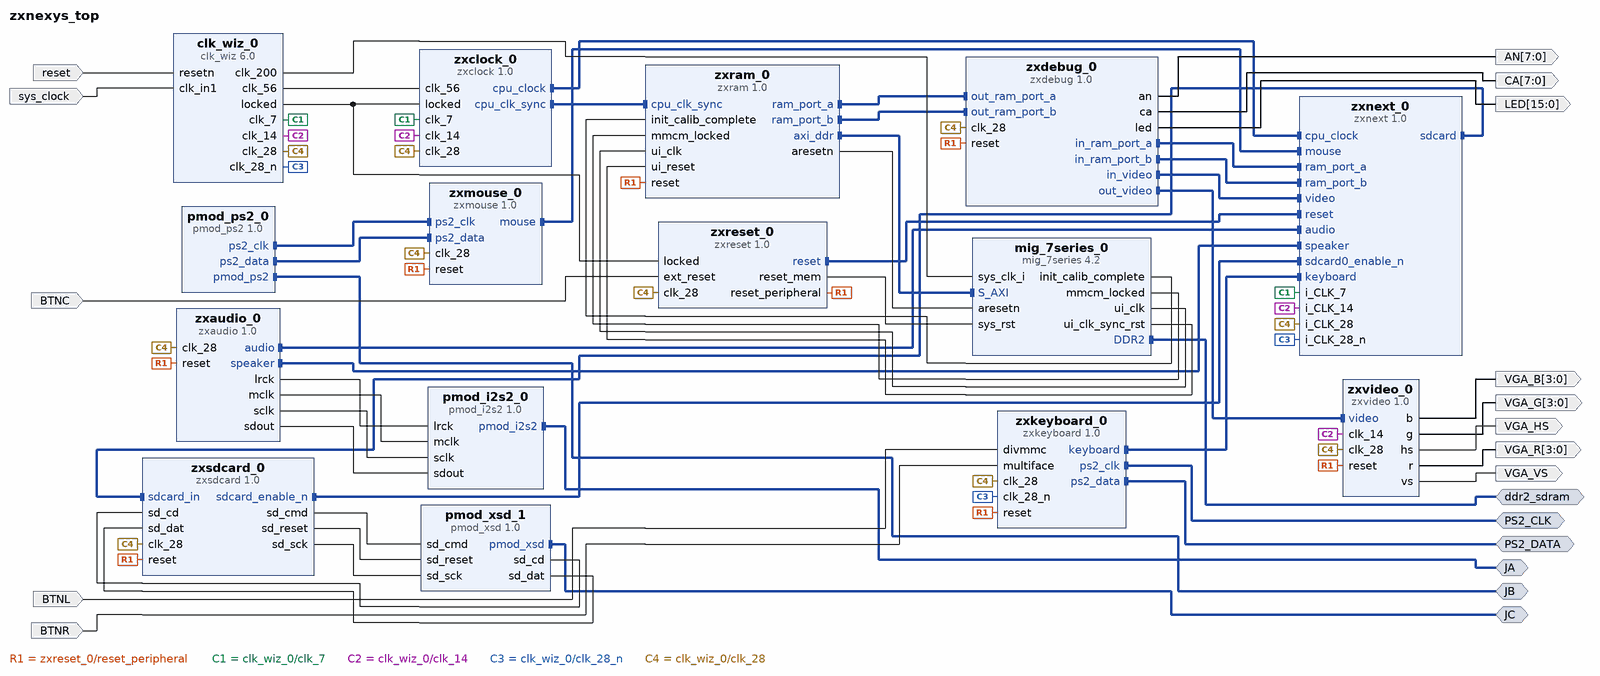
[diagram p0: block diagram of the top level]
# Vivado block design zxnexys_top, xc7a100tcsg324-1, Vivado 2021.1.1
create_bd_design zxnexys_top

create_bd_intf_port -mode Master -vlnv digilentinc.com:interface:pmod_rtl:1.0 JA
create_bd_intf_port -mode Master -vlnv digilentinc.com:interface:pmod_rtl:1.0 JB
create_bd_intf_port -mode Master -vlnv xilinx.com:interface:gpio_rtl:1.0 PS2_CLK
create_bd_intf_port -mode Master -vlnv xilinx.com:interface:gpio_rtl:1.0 PS2_DATA
create_bd_intf_port -mode Master -vlnv digilentinc.com:interface:pmod_rtl:1.0 JC
create_bd_intf_port -mode Master -vlnv xilinx.com:interface:ddrx_rtl:1.0 ddr2_sdram
create_bd_port -dir I BTNL
create_bd_port -dir I BTNR
create_bd_port -dir O -from 3 -to 0 VGA_R
create_bd_port -dir O -from 3 -to 0 VGA_G
create_bd_port -dir O -from 3 -to 0 VGA_B
create_bd_port -dir O VGA_HS
create_bd_port -dir O VGA_VS
create_bd_port -dir I BTNC
create_bd_port -dir O -from 7 -to 0 CA
create_bd_port -dir O -from 7 -to 0 AN
create_bd_port -dir O -from 15 -to 0 LED
create_bd_port -dir I -type clk sys_clock
set_property -dict {CONFIG.FREQ_HZ 100000000 CONFIG.PHASE 0.0} [get_bd_ports sys_clock]
create_bd_port -dir I -type rst reset
set_property -dict {CONFIG.POLARITY ACTIVE_LOW} [get_bd_ports reset]

create_bd_cell -type ip -vlnv specnext.com:specnext:zxaudio:1.0 zxaudio_0
create_bd_cell -type ip -vlnv specnext.com:specnext:zxkeyboard:1.0 zxkeyboard_0
create_bd_cell -type ip -vlnv specnext.com:specnext:zxmouse:1.0 zxmouse_0
create_bd_cell -type ip -vlnv specnext.com:specnext:zxvideo:1.0 zxvideo_0
create_bd_cell -type ip -vlnv sepcnext.com:specnext:pmod_i2s2:1.0 pmod_i2s2_0
create_bd_cell -type ip -vlnv specnext.com:specnext:pmod_ps2:1.0 pmod_ps2_0
create_bd_cell -type ip -vlnv specnext.com:specnext:pmod_xsd:1.0 pmod_xsd_1
create_bd_cell -type ip -vlnv xilinx.com:ip:mig_7series:4.2 mig_7series_0
set_property -dict [list \
  CONFIG.BOARD_MIG_PARAM ddr2_sdram \
  CONFIG.MIG_DONT_TOUCH_PARAM Custom \
  CONFIG.RESET_BOARD_INTERFACE Custom \
  CONFIG.XML_INPUT_FILE mig_b.prj \
] [get_bd_cells mig_7series_0]
create_bd_cell -type ip -vlnv specnext.com:specnext:zxsdcard:1.0 zxsdcard_0
create_bd_cell -type ip -vlnv specnext.com:specnext:zxdebug:1.0 zxdebug_0
create_bd_cell -type ip -vlnv specnext.com:specnext:zxreset:1.0 zxreset_0
create_bd_cell -type ip -vlnv specnext.com:specnext:zxnext:1.0 zxnext_0
create_bd_cell -type ip -vlnv specnext.com:specnext:zxram:1.0 zxram_0
create_bd_cell -type ip -vlnv xilinx.com:ip:clk_wiz:6.0 clk_wiz_0
set_property -dict [list \
  CONFIG.CLKOUT1_JITTER 120.598 \
  CONFIG.CLKOUT1_PHASE_ERROR 105.461 \
  CONFIG.CLKOUT1_REQUESTED_OUT_FREQ 200 \
  CONFIG.CLKOUT2_JITTER 155.428 \
  CONFIG.CLKOUT2_PHASE_ERROR 105.461 \
  CONFIG.CLKOUT2_REQUESTED_OUT_FREQ 56.25 \
  CONFIG.CLKOUT2_USED true \
  CONFIG.CLKOUT3_JITTER 179.253 \
  CONFIG.CLKOUT3_PHASE_ERROR 105.461 \
  CONFIG.CLKOUT3_REQUESTED_OUT_FREQ 28.125 \
  CONFIG.CLKOUT3_USED true \
  CONFIG.CLKOUT4_JITTER 179.253 \
  CONFIG.CLKOUT4_PHASE_ERROR 105.461 \
  CONFIG.CLKOUT4_REQUESTED_OUT_FREQ 28.125 \
  CONFIG.CLKOUT4_USED true \
  CONFIG.CLKOUT5_JITTER 205.339 \
  CONFIG.CLKOUT5_PHASE_ERROR 105.461 \
  CONFIG.CLKOUT5_REQUESTED_OUT_FREQ 14.0625 \
  CONFIG.CLKOUT5_USED true \
  CONFIG.CLKOUT6_JITTER 234.771 \
  CONFIG.CLKOUT6_PHASE_ERROR 105.461 \
  CONFIG.CLKOUT6_REQUESTED_OUT_FREQ 7.03125 \
  CONFIG.CLKOUT6_USED true \
  CONFIG.CLK_IN1_BOARD_INTERFACE sys_clock \
  CONFIG.CLK_OUT1_PORT clk_200 \
  CONFIG.CLK_OUT4_PORT clk_28_n \
  CONFIG.MMCM_CLKFBOUT_MULT_F 9.000 \
  CONFIG.MMCM_CLKOUT0_DIVIDE_F 4.500 \
  CONFIG.MMCM_CLKOUT1_DIVIDE 16 \
  CONFIG.MMCM_CLKOUT2_DIVIDE 32 \
  CONFIG.MMCM_CLKOUT3_DIVIDE 32 \
  CONFIG.MMCM_CLKOUT4_DIVIDE 64 \
  CONFIG.MMCM_CLKOUT5_DIVIDE 128 \
  CONFIG.NUM_OUT_CLKS 6 \
  CONFIG.RESET_BOARD_INTERFACE reset \
  CONFIG.RESET_PORT resetn \
  CONFIG.RESET_TYPE ACTIVE_LOW \
  CONFIG.USE_BOARD_FLOW true \
] [get_bd_cells clk_wiz_0]
create_bd_cell -type ip -vlnv specnext.com:specnext:zxclock:1.0 zxclock_0

# ---- connections ----

connect_bd_intf_net [get_bd_intf_ports ddr2_sdram] [get_bd_intf_pins mig_7series_0/DDR2]
connect_bd_intf_net [get_bd_intf_ports JA] [get_bd_intf_pins pmod_i2s2_0/pmod_i2s2]
connect_bd_intf_net [get_bd_intf_ports JB] [get_bd_intf_pins pmod_ps2_0/pmod_ps2]
connect_bd_intf_net [get_bd_intf_ports JC] [get_bd_intf_pins pmod_xsd_1/pmod_xsd]
connect_bd_intf_net [get_bd_intf_pins zxclock_0/cpu_clk_sync] [get_bd_intf_pins zxram_0/cpu_clk_sync]
connect_bd_intf_net [get_bd_intf_pins zxclock_0/cpu_clock] [get_bd_intf_pins zxnext_0/cpu_clock]
connect_bd_intf_net [get_bd_intf_pins zxram_0/ram_port_a] [get_bd_intf_pins zxdebug_0/out_ram_port_a]
connect_bd_intf_net [get_bd_intf_pins zxram_0/ram_port_b] [get_bd_intf_pins zxdebug_0/out_ram_port_b]
connect_bd_intf_net [get_bd_intf_pins zxdebug_0/out_video] [get_bd_intf_pins zxvideo_0/video]
connect_bd_intf_net [get_bd_intf_ports PS2_CLK] [get_bd_intf_pins zxkeyboard_0/ps2_clk]
connect_bd_intf_net [get_bd_intf_ports PS2_DATA] [get_bd_intf_pins zxkeyboard_0/ps2_data]
connect_bd_intf_net [get_bd_intf_pins pmod_ps2_0/ps2_clk] [get_bd_intf_pins zxmouse_0/ps2_clk]
connect_bd_intf_net [get_bd_intf_pins pmod_ps2_0/ps2_data] [get_bd_intf_pins zxmouse_0/ps2_data]
connect_bd_intf_net [get_bd_intf_pins zxaudio_0/audio] [get_bd_intf_pins zxnext_0/audio]
connect_bd_intf_net [get_bd_intf_pins zxkeyboard_0/keyboard] [get_bd_intf_pins zxnext_0/keyboard]
connect_bd_intf_net [get_bd_intf_pins zxmouse_0/mouse] [get_bd_intf_pins zxnext_0/mouse]
connect_bd_intf_net [get_bd_intf_pins zxdebug_0/in_ram_port_a] [get_bd_intf_pins zxnext_0/ram_port_a]
connect_bd_intf_net [get_bd_intf_pins zxdebug_0/in_ram_port_b] [get_bd_intf_pins zxnext_0/ram_port_b]
connect_bd_intf_net [get_bd_intf_pins zxsdcard_0/sdcard_in] [get_bd_intf_pins zxnext_0/sdcard]
connect_bd_intf_net [get_bd_intf_pins zxsdcard_0/sdcard_enable_n] [get_bd_intf_pins zxnext_0/sdcard0_enable_n]
connect_bd_intf_net [get_bd_intf_pins zxaudio_0/speaker] [get_bd_intf_pins zxnext_0/speaker]
connect_bd_intf_net [get_bd_intf_pins zxdebug_0/in_video] [get_bd_intf_pins zxnext_0/video]
connect_bd_intf_net [get_bd_intf_pins zxram_0/axi_ddr] [get_bd_intf_pins mig_7series_0/S_AXI]
connect_bd_intf_net [get_bd_intf_pins zxreset_0/reset] [get_bd_intf_pins zxnext_0/reset]
connect_bd_net [get_bd_ports BTNC] [get_bd_pins zxreset_0/ext_reset]
connect_bd_net [get_bd_ports BTNL] [get_bd_pins zxkeyboard_0/divmmc]
connect_bd_net [get_bd_ports BTNR] [get_bd_pins zxkeyboard_0/multiface]
connect_bd_net [get_bd_pins zxreset_0/reset_peripheral] \
  [get_bd_pins zxaudio_0/reset] [get_bd_pins zxkeyboard_0/reset] [get_bd_pins zxmouse_0/reset] [get_bd_pins zxvideo_0/reset] \
  [get_bd_pins zxsdcard_0/reset] [get_bd_pins zxdebug_0/reset] [get_bd_pins zxram_0/reset]
connect_bd_net [get_bd_pins clk_wiz_0/clk_7] [get_bd_pins zxnext_0/i_CLK_7] [get_bd_pins zxclock_0/clk_7]
connect_bd_net [get_bd_pins clk_wiz_0/clk_14] [get_bd_pins zxvideo_0/clk_14] [get_bd_pins zxnext_0/i_CLK_14] [get_bd_pins zxclock_0/clk_14]
connect_bd_net [get_bd_pins clk_wiz_0/clk_56] [get_bd_pins zxclock_0/clk_56]
connect_bd_net [get_bd_pins clk_wiz_0/clk_200] [get_bd_pins mig_7series_0/sys_clk_i]
connect_bd_net [get_bd_pins clk_wiz_0/clk_28_n] [get_bd_pins zxkeyboard_0/clk_28_n] [get_bd_pins zxnext_0/i_CLK_28_n]
connect_bd_net [get_bd_pins clk_wiz_0/locked] [get_bd_pins zxreset_0/locked] [get_bd_pins zxclock_0/locked]
connect_bd_net [get_bd_pins mig_7series_0/init_calib_complete] [get_bd_pins zxram_0/init_calib_complete]
connect_bd_net [get_bd_pins mig_7series_0/mmcm_locked] [get_bd_pins zxram_0/mmcm_locked]
connect_bd_net [get_bd_pins mig_7series_0/ui_clk] [get_bd_pins zxram_0/ui_clk]
connect_bd_net [get_bd_pins mig_7series_0/ui_clk_sync_rst] [get_bd_pins zxram_0/ui_reset]
connect_bd_net [get_bd_pins pmod_xsd_1/sd_cd] [get_bd_pins zxsdcard_0/sd_cd]
connect_bd_net [get_bd_pins pmod_xsd_1/sd_dat] [get_bd_pins zxsdcard_0/sd_dat]
connect_bd_net [get_bd_ports reset] [get_bd_pins clk_wiz_0/resetn]
connect_bd_net [get_bd_ports sys_clock] [get_bd_pins clk_wiz_0/clk_in1]
connect_bd_net [get_bd_pins zxaudio_0/lrck] [get_bd_pins pmod_i2s2_0/lrck]
connect_bd_net [get_bd_pins zxaudio_0/mclk] [get_bd_pins pmod_i2s2_0/mclk]
connect_bd_net [get_bd_pins zxaudio_0/sclk] [get_bd_pins pmod_i2s2_0/sclk]
connect_bd_net [get_bd_pins zxaudio_0/sdout] [get_bd_pins pmod_i2s2_0/sdout]
connect_bd_net -net zxclock_0_clk_29 [get_bd_pins clk_wiz_0/clk_28] \
  [get_bd_pins zxaudio_0/clk_28] [get_bd_pins zxkeyboard_0/clk_28] [get_bd_pins zxmouse_0/clk_28] \
  [get_bd_pins zxvideo_0/clk_28] [get_bd_pins zxsdcard_0/clk_28] [get_bd_pins zxdebug_0/clk_28] \
  [get_bd_pins zxreset_0/clk_28] [get_bd_pins zxnext_0/i_CLK_28] [get_bd_pins zxclock_0/clk_28]
connect_bd_net [get_bd_pins zxdebug_0/an] [get_bd_ports AN]
connect_bd_net [get_bd_pins zxdebug_0/ca] [get_bd_ports CA]
connect_bd_net [get_bd_pins zxdebug_0/led] [get_bd_ports LED]
connect_bd_net [get_bd_pins zxram_0/aresetn] [get_bd_pins mig_7series_0/aresetn]
connect_bd_net [get_bd_pins zxreset_0/reset_mem] [get_bd_pins mig_7series_0/sys_rst]
connect_bd_net [get_bd_pins zxsdcard_0/sd_cmd] [get_bd_pins pmod_xsd_1/sd_cmd]
connect_bd_net [get_bd_pins zxsdcard_0/sd_reset] [get_bd_pins pmod_xsd_1/sd_reset]
connect_bd_net [get_bd_pins zxsdcard_0/sd_sck] [get_bd_pins pmod_xsd_1/sd_sck]
connect_bd_net [get_bd_pins zxvideo_0/b] [get_bd_ports VGA_B]
connect_bd_net [get_bd_pins zxvideo_0/g] [get_bd_ports VGA_G]
connect_bd_net [get_bd_pins zxvideo_0/hs] [get_bd_ports VGA_HS]
connect_bd_net [get_bd_pins zxvideo_0/r] [get_bd_ports VGA_R]
connect_bd_net [get_bd_pins zxvideo_0/vs] [get_bd_ports VGA_VS]

# ---- address map ----
assign_bd_address -offset 0x0000000 -range 128M -target_address_space [get_bd_addr_spaces zxram_0/axi_ddr] [get_bd_addr_segs mig_7series_0/memmap/memaddr]

validate_bd_design
save_bd_design
